# Altium schematic sheet MPU_SHC.SchDoc
size 420 x 297 mm; Address1: Address1; Address2: Address2; Address3: Address3; Address4: Address4; SheetNumber: 1; Scale: 1:1; Разраб.: Иванов; Обозначение документа: АБВГ.123456.001 Э3; Пров.: Петров; Утв.: Сидоров; Наименование организации: ОАО "Концерн "МПО-Гидроприбор"; Перв. применение: АБВГ.123456.000; Наименование изделия 1: Плата; Наименование изделия 2: Схема электрическая; Наименование изделия 3: принципиальная; Нач. отд.: Нач. отд.; Фамилия нач. отд.: Сидоров
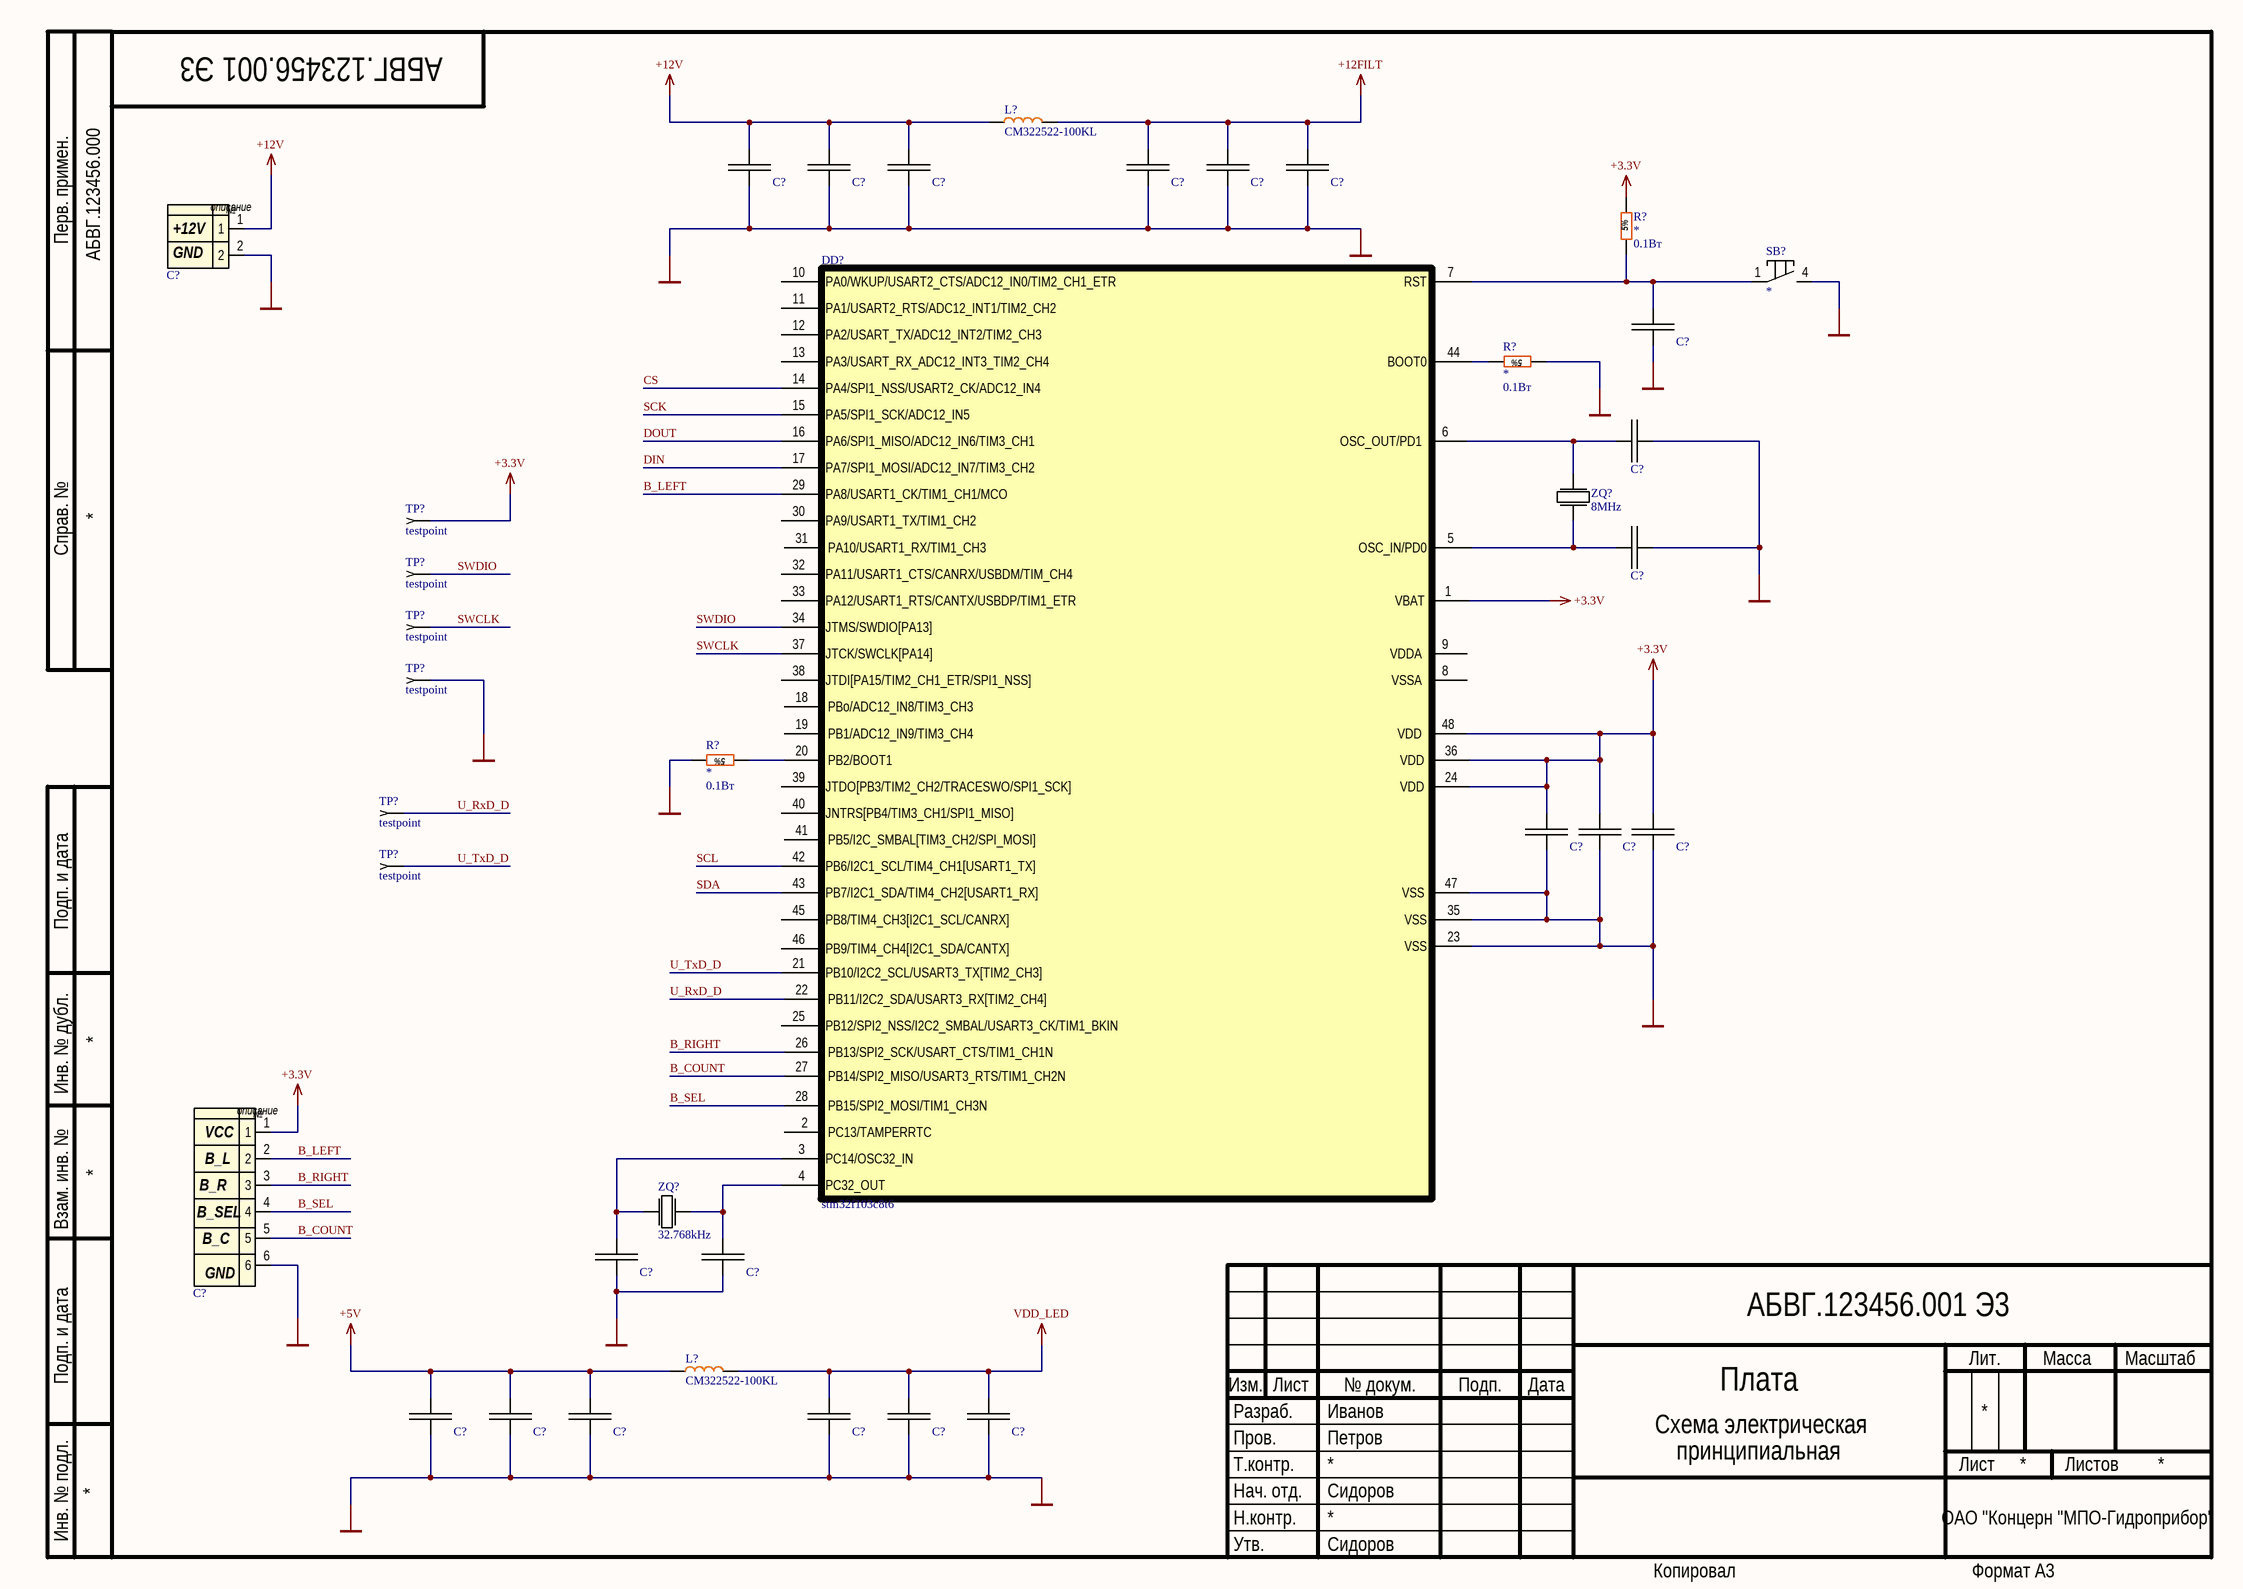
[diagram p0: MPU_SHC.SchDoc]

## Parts
(Parts that share a designator on the sheet are numbered #1, #2 ... from top to bottom, then left to right.)
C?#1  *  [CH0603L]  (value not drawn)
C?#2  *  [CH0805C]  (value not drawn)
C?#3  *  [CAP1206]  (value not drawn)
C?#4  *  [CH0603L]  (value not drawn)
C?#5  *  [CH0805C]  (value not drawn)
C?#6  *  [CAP1206]  (value not drawn)
C?#7  DS1069-2 MR-A  [DS1069-2]  (value not drawn)
C?#8  *  [CH0603L]  (value not drawn)
C?#9  *  [CH0603L]  (value not drawn)
C?#10  *  [CH0603L]  (value not drawn)
C?#11  *  [CH0603L]  (value not drawn)
C?#12  *  [CH0603L]  (value not drawn)
C?#13  *  [CH0603L]  (value not drawn)
C?#14  DS1069-6 MR-A_1  [DS1069-6 MR-A]  (value not drawn)
C?#15  *  [CH0603L]  (value not drawn)
C?#16  *  [CH0603L]  (value not drawn)
C?#17  *  [CH0603L]  (value not drawn)
C?#18  *  [CH0805C]  (value not drawn)
C?#19  *  [CAP1206]  (value not drawn)
C?#20  *  [CH0603L]  (value not drawn)
C?#21  *  [CH0805C]  (value not drawn)
C?#22  *  [CAP1206]  (value not drawn)
DD?  stm32f103c8t6  [48-LQFP]
L?#1  CM322522-100KL  [1210]
L?#2  CM322522-100KL  [1210]
R?#1  Power: 0.1Вт  [Res0603]  (hidden comment: *)
R?#2  Power: 0.1Вт  [Res0603]  (hidden comment: *)
R?#3  Power: 0.1Вт  [Res0603]  (hidden comment: *)
SB?  *  [KLS2]
TP?#1  testpoint  [testpoint]
TP?#2  testpoint  [testpoint]
TP?#3  testpoint  [testpoint]
TP?#4  testpoint  [testpoint]
TP?#5  testpoint  [testpoint]
TP?#6  testpoint  [testpoint]
ZQ?#1  8MHz  [SMD0503]
ZQ?#2  32.768kHz  [smd03215c2]

## Nets
+3.3V: C?#11.1 C?#12.1 C?#13.1 C?#14.1 DD?.1(VBAT) DD?.24(VDD) DD?.36(VDD) DD?.48(VDD) R?#1.2 TP?#1.1
+5V: C?#17.1 C?#18.1 C?#19.1 L?#2.1(SENSE)
+12FILT: C?#4.1 C?#5.1 C?#6.1 L?#1.2(GND)
+12V: C?#1.1 C?#2.1 C?#3.1 C?#7.1 L?#1.1(SENSE)
GND: C?#1.2 C?#2.2 C?#3.2 C?#4.2 C?#5.2 C?#6.2 C?#7.2 C?#8.1 C?#9.2 C?#10.2 C?#11.2 C?#12.2 C?#13.2 C?#14.6 C?#15.2 C?#16.2 C?#17.2 C?#18.2 C?#19.2 C?#20.2 C?#21.2 C?#22.2 DD?.23(VSS) DD?.35(VSS) DD?.47(VSS) R?#2.1 R?#3.2 SB?.4 TP?#4.1
VDD_LED: C?#20.1 C?#21.1 C?#22.1 L?#2.2(GND)
B_COUNT: C?#14.5 DD?.27(PB14/SPI2_MISO/USART3_RTS/TIM1_CH2N)
B_LEFT: C?#14.2 DD?.29(PA8/USART1_CK/TIM1_CH1/MCO)
B_RIGHT: C?#14.3 DD?.26(PB13/SPI2_SCK/USART_CTS/TIM1_CH1N)
B_SEL: C?#14.4 DD?.28(PB15/SPI2_MOSI/TIM1_CH3N)
CS: DD?.14(PA4/SPI1_NSS/USART2_CK/ADC12_IN4)
DIN: DD?.17(PA7/SPI1_MOSI/ADC12_IN7/TIM3_CH2)
DOUT: DD?.16(PA6/SPI1_MISO/ADC12_IN6/TIM3_CH1)
SCK: DD?.15(PA5/SPI1_SCK/ADC12_IN5)
SCL: DD?.42(PB6/I2C1_SCL/TIM4_CH1[USART1_TX])
SDA: DD?.43(PB7/I2C1_SDA/TIM4_CH2[USART1_RX])
SWCLK: DD?.37(JTCK/SWCLK[PA14]) TP?#3.1
SWDIO: DD?.34(JTMS/SWDIO[PA13]) TP?#2.1
U_RxD_D: DD?.22(PB11/I2C2_SDA/USART3_RX[TIM2_CH4]) TP?#5.1
U_TxD_D: DD?.21(PB10/I2C2_SCL/USART3_TX[TIM2_CH3]) TP?#6.1
NetC?#8_2: C?#8.2 DD?.7(RST) R?#1.1 SB?.1
NetC?#9_1: C?#9.1 DD?.6(OSC_OUT/PD1) ZQ?#1.3
NetC?#10_1: C?#10.1 DD?.5(OSC_IN/PD0) ZQ?#1.1
NetC?#15_1: C?#15.1 DD?.3(PC14/OSC32_IN) ZQ?#2.1
NetC?#16_1: C?#16.1 DD?.4(PC32_OUT) ZQ?#2.2
NetDD?_20: DD?.20(PB2/BOOT1) R?#3.1
NetDD?_44: DD?.44(BOOT0) R?#2.2

Not connected (* = marked no-connect by the designer): DD? 2(PC13/TAMPERRTC) 8(VSSA) 9(VDDA) 10(PA0/WKUP/USART2_CTS/ADC12_IN0/TIM2_CH1_ETR) 11(PA1/USART2_RTS/ADC12_INT1/TIM2_CH2) 12(PA2/USART_TX/ADC12_INT2/TIM2_CH3) 13(PA3/USART_RX_ADC12_INT3_TIM2_CH4) 18(PBo/ADC12_IN8/TIM3_CH3) 19(PB1/ADC12_IN9/TIM3_CH4) 25(PB12/SPI2_NSS/I2C2_SMBAL/USART3_CK/TIM1_BKIN) 30(PA9/USART1_TX/TIM1_CH2) 31(PA10/USART1_RX/TIM1_CH3) 32(PA11/USART1_CTS/CANRX/USBDM/TIM_CH4) 33(PA12/USART1_RTS/CANTX/USBDP/TIM1_ETR) 38(JTDI[PA15/TIM2_CH1_ETR/SPI1_NSS]) 39(JTDO[PB3/TIM2_CH2/TRACESWO/SPI1_SCK]) 40(JNTRS[PB4/TIM3_CH1/SPI1_MISO]) 41(PB5/I2C_SMBAL[TIM3_CH2/SPI_MOSI]) 45(PB8/TIM4_CH3[I2C1_SCL/CANRX]) 46(PB9/TIM4_CH4[I2C1_SDA/CANTX])

## Notes on the sheet
- (near C?#7) +12V
- (near C?#7) GND
- (near C?#14) VCC
- (near C?#14) B_R
- (near C?#14) B_L
- (near C?#14) B_SEL
- (near C?#14) B_C
- (near C?#14) GND
- Перв. примен.
- Справ. №
- Подп. и дата
- Инв. № дубл.
- Взам. инв. №
- Разраб.
- Изм.
- Лист
- № докум.
- Подп.
- Дата
- Лит.
- Масса
- Масштаб
- Пров.
- Т.контр.
- Листов
- Инв. № подл.
- Утв.
- Н.контр.
- Копировал
- Формат А3
- (in symbol DS1069-2 MR-A) описание; №
- (in symbol DS1069-6 MR-A) описание; №

## Library data of the parts
C?#1-C?#6 C?#8-C?#13 C?#15-C?#22 = Capasitor: Value: *; Voltage: *; Part Number: *; Quantity: *; Package: *; Price: *; Manufacturer: *; ShoppingPlace: *
C?#7 = DS1069-2 MR-A: Manufacturer: Ningbo connfly electronic; Value: 1A; Voltage: 250V; Part Number: DS1069-2 MR-A; Quantity: 1; Package: DS1069-2- 2.5mm; Price: 0,18; ShoppingPlace: https://www.ru-chipdip.by/product/cwf-2r-ds1069-2-mr; Ответная часть: https://www.ru-chipdip.by/product/chu-2
C?#14 = DS1069-6 MR-A: Manufacturer: Ningbo connfly electronic; Value: 1A; Voltage: 250V; Part Number: DS1069-6 MR-A_1; Quantity: 1; Package: DS1069-6 MR-A_1- 2.5mm; Price: 0,18; ShoppingPlace: https://www.ru-chipdip.by/product/cwf-6r-ds1069-6-mr; Ответная часть: https://www.ru-chipdip.by/product/chu-6
DD? = stm32f103c8t6: Manufacturer: STM; Part Number: stm32f103c8t6; Package: LQFP48; Quantity: 1; Tolerance: *; Type: IC; Voltage: *; Power: *
L?#1 L?#2 = CM322522-100KL: Manufacturer: Bourns; Value: 10uГн; Tolerance: +-10%; Type: L; Power: 140mA; Part Number: CM322522-100KL; Price: 0,35; ShoppingPlace: https://www.ru-chipdip.by/product/cm322522-100kl; Package: 1210; Quantity: 1; Voltage: *; Documentation: http://www.farnell.com/datasheets/2360599.pdf
R?#1-R?#3 = Res0603_5%: Voltage: 50В; Tolerance: 5%; Manufacturer: *; Quntity: *; Price: *; Part Number: *; Package: 0603; Doc: *; Value: *
SB? = Button: Part Number: *; Price: *; Value: *; ShoppingPlace: *; Quantity: *; Package: *; Manufacturer: *; Documantation: *; Type: SB
TP?#1-TP?#6 = P
ZQ?#1 = SMD0503: Voltage: China; Part Number: SMD0503; Price: 1,2; ShoppingPlace: https://www.ru-chipdip.by/product0/9000341671; Package: SMD0503; Value: 8MHz; Quantity: 1; Type: ZQ; Documentation: https://static.chipdip.ru/lib/652/DOC001652773.pdf
ZQ?#2 = FC-135: Voltage: China; Part Number: FC-135; Price: 0,90; ShoppingPlace: https://www.ru-chipdip.by/product0/9000372611; Package: smd03215c2; Value: 32.768kHz; Quantity: 1; Type: ZQ; Documentation: https://static.chipdip.ru/lib/484/DOC001484714.pdf